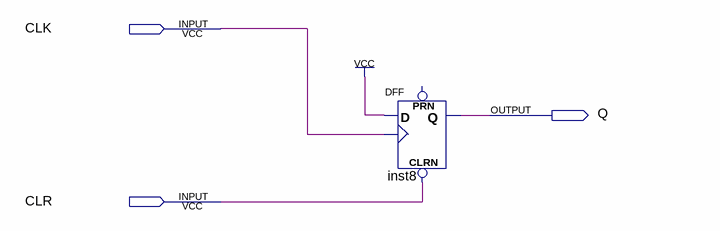
[diagram p0: schematic sheet]
// Quartus schematic ScanEdge.bdf as structural Verilog: 1 symbols, 3 pins
module ScanEdge (
  input  CLK,
  input  CLR,
  output Q
);

  DFF inst8 (.CLRN(CLR), .CLK(CLK), .D(1'b1), .Q(Q));  // open: PRN
endmodule
